# Altium schematic sheet Sheet2.SchDoc
size B; SheetNumber: 1; SheetTotal: 1
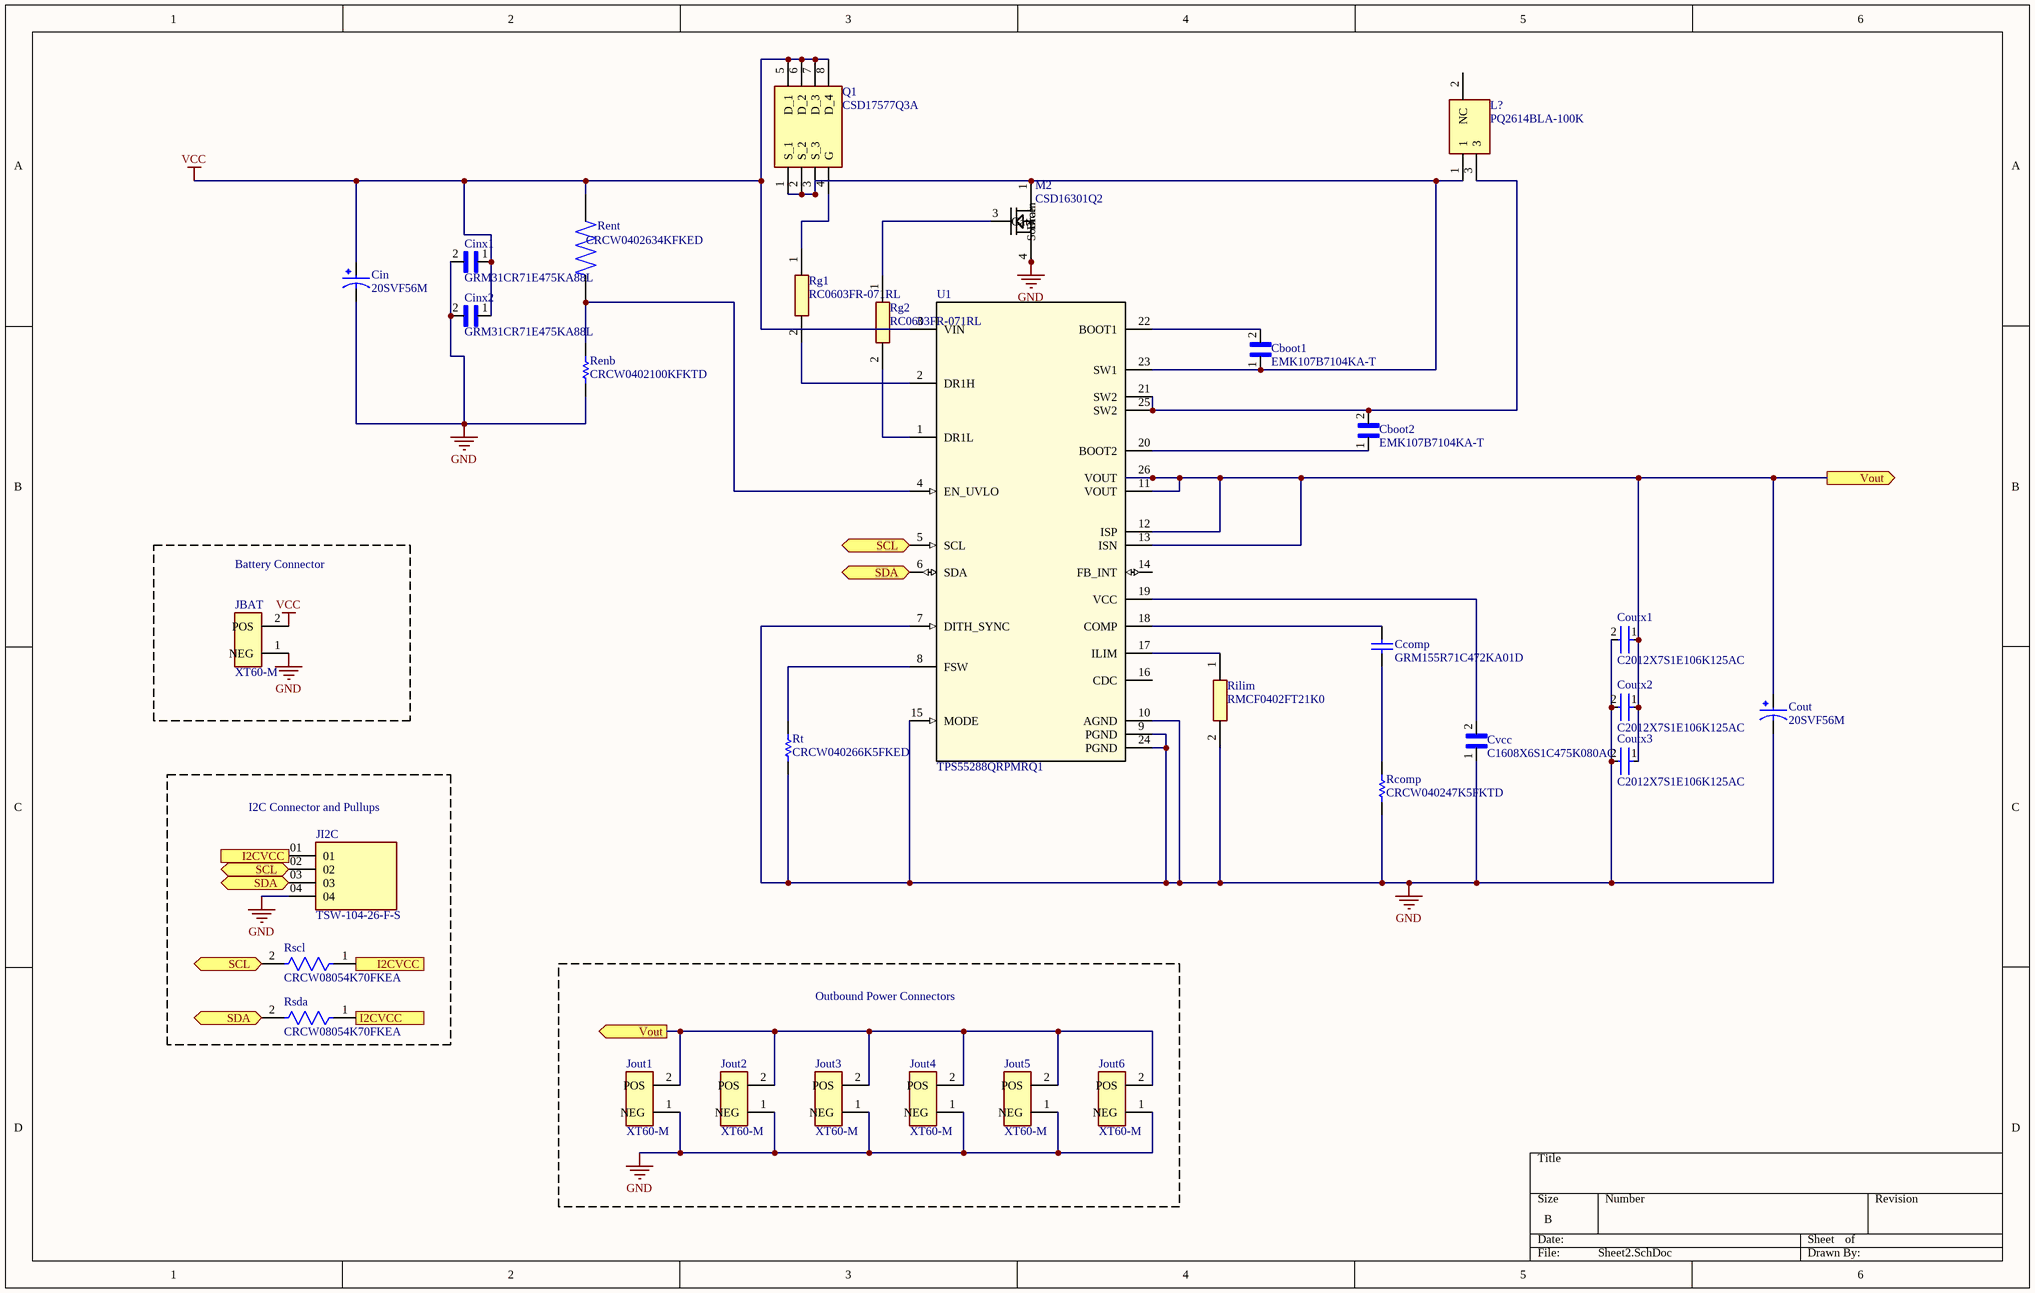
[diagram p0: Sheet2.SchDoc]

## Parts
Cboot1  EMK107B7104KA-T  [CAPC1608X90N]
Cboot2  EMK107B7104KA-T  [CAPC1608X90N]
Ccomp  GRM155R71C472KA01D  [CAPC1005X55X25LL05T10]
Cin  20SVF56M  [CAP_20SVF56M]
Cinx1  GRM31CR71E475KA88L  [CAP3216X125N]
Cinx2  GRM31CR71E475KA88L  [CAP3216X125N]
Cout  20SVF56M  [CAP_20SVF56M]
Coutx1  C2012X7S1E106K125AC  [FP-C2012-125-IPC_A]
Coutx2  C2012X7S1E106K125AC  [FP-C2012-125-IPC_A]
Coutx3  C2012X7S1E106K125AC  [FP-C2012-125-IPC_A]
Cvcc  C1608X6S1C475K080AC  [CAPC1608X90N]
JBAT  XT60-M  [AMASS_XT60-M]
JI2C  TSW-104-26-F-S  [SAMTEC_TSW-104-26-F-S]
Jout1  XT60-M  [AMASS_XT60-M]
Jout2  XT60-M  [AMASS_XT60-M]
Jout3  XT60-M  [AMASS_XT60-M]
Jout4  XT60-M  [AMASS_XT60-M]
Jout5  XT60-M  [AMASS_XT60-M]
Jout6  XT60-M  [AMASS_XT60-M]
L?  PQ2614BLA-100K  [PQ2614BLA100K]
M2  CSD16301Q2  [DQK0006C]
Q1  CSD17577Q3A  [Q3A]
Rcomp  CRCW040247K5FKTD  [RESC1005X40X25LL05T05]
Renb  CRCW0402100KFKTD  [RESC1005X40X25ML05T05]
Rent  CRCW0402634KFKED  [RESC1005X40N]
Rg1  RC0603FR-071RL  [RESC1608X55N]
Rg2  RC0603FR-071RL  [RESC1608X55N]
Rilim  RMCF0402FT21K0  [RESC1005X40N]
Rscl  CRCW08054K70FKEA  [FP-CRCW0805-e3-IPC_B]
Rsda  CRCW08054K70FKEA  [FP-CRCW0805-e3-IPC_B]
Rt  CRCW040266K5FKED  [RESC1005X40X25ML05T05]
U1  TPS55288QRPMRQ1  [RPM0026A-MFG]

## Blocks framed on the sheet
Battery Connector: JBAT
I2C Connector and Pullups: JI2C Rscl Rsda
Outbound Power Connectors: Jout1-Jout6

## Ports
I2CVCC, SCL (bidir), SDA (bidir), Vout (out)

## Nets
GND: Cin.2 Cinx1.2 Cinx2.2 Cout.2 Coutx1.2 Coutx2.2 Coutx3.2 Cvcc.1 JBAT.1(NEG) JI2C.04 Jout1.1(NEG) Jout2.1(NEG) Jout3.1(NEG) Jout4.1(NEG) Jout5.1(NEG) Jout6.1(NEG) M2.4(Source) M2.7(Source) Rcomp.1 Renb.1 Rilim.2 Rt.1 U1.7(DITH_SYNC) U1.9(PGND) U1.10(AGND) U1.15(MODE) U1.24(PGND)
VCC: Cin.1 Cinx1.1 Cinx2.1 JBAT.2(POS) Q1.5(D_1) Q1.6(D_2) Q1.7(D_3) Q1.8(D_4) Rent.2 U1.3(VIN)
I2CVCC: JI2C.01 Rscl.1 Rsda.1 ; port I2CVCC
SCL: JI2C.02 Rscl.2 U1.5(SCL) ; port SCL
SDA: JI2C.03 Rsda.2 U1.6(SDA) ; port SDA
Vout: Cout.1 Coutx1.1 Coutx2.1 Coutx3.1 Jout1.2(POS) Jout2.2(POS) Jout3.2(POS) Jout4.2(POS) Jout5.2(POS) Jout6.2(POS) U1.11(VOUT) U1.12(ISP) U1.13(ISN) U1.26(VOUT) ; port Vout
NetCboot1_1: Cboot1.1 L?.1 M2.1(Drain) M2.2(Drain) M2.5(Drain) M2.6(Drain) M2.8(Drain) Q1.1(S_1) Q1.2(S_2) Q1.3(S_3) U1.23(SW1)
NetCboot1_2: Cboot1.2 U1.22(BOOT1)
NetCboot2_1: Cboot2.1 U1.20(BOOT2)
NetCboot2_2: Cboot2.2 L?.3 U1.21(SW2) U1.25(SW2)
NetCcomp_1: Ccomp.1 Rcomp.2
NetCcomp_2: Ccomp.2 U1.18(COMP)
NetCvcc_2: Cvcc.2 U1.19(VCC)
NetM2_3: M2.3(Gate) Rg2.1
NetQ1_4: Q1.4(G) Rg1.1
NetRenb_2: Renb.2 Rent.1 U1.4(EN_UVLO)
NetRg1_2: Rg1.2 U1.2(DR1H)
NetRg2_2: Rg2.2 U1.1(DR1L)
NetRilim_1: Rilim.1 U1.17(ILIM)
NetRt_2: Rt.2 U1.8(FSW)

Not connected (* = marked no-connect by the designer): L? 2(NC); U1 14(FB_INT) 16(CDC)

## Library data of the parts
Cboot1 Cboot2 = EMK107B7104KA-T: Ceramic Multilayer Capacitor; Capacitor Type:General Purpose; Capacitance:0.1ÂµF; Capacitance Tolerance:Â± 10%; Voltage Rating:16VDC; Capacitor Dielectric Type:Multilayer Ceramic; Package/Case:0603; Termination Type:SMD ;RoHS Compliant: Yes; MF: {'manufacturer': u'Taiyo Yuden'}; MP: EMK107B7104KA-T; Price: None; Availability: Unavailable; Value: *; Package: None
Ccomp = CMP-2008-04609-1: Manufacturer: Murata; Part Number: GRM155R71C472KA01D
Cin Cout = 20SVF56M: MF: {'manufacturer': u'Panasonic'}; Value: *; Availability: Unavailable; MP: 20SVF56M; Price: None; Package: None
Cinx1 Cinx2 = GRM31CR71H475KA12L: Cap Ceramic 4.7uF 50V X7R 10% Pad SMD 1206 125C T/R; MF: {'manufacturer': u'Murata'}; Value: *; Availability: Unavailable; MP: GRM31CR71H475KA12L; Price: None; Package: None
Coutx1-Coutx3 = CMP-08246-000200-1: CAP CER 10UF 25V X7S 0805
Cvcc = C1608X6S1C475K080AC: Cap Ceramic 4.7uF 16V X6S 10% SMD 0603 105Â°C Punched Paper T/R; MF: {'manufacturer': u'TDK'}; MP: C1608X6S1C475K080AC; Price: None; Availability: Unavailable; Value: *; Package: None
JBAT Jout1-Jout6 = XT60-M: Plug; DC supply; XT60; male; PIN: 2; for cable; soldered; 30A; 500V; MF: AMASS; MP: XT60-M; Price: None; Package: Package Analog Devices; Value: *; Availability: Unavailable; SnapEDA_Link: https://www.snapeda.com/parts/XT60-M/AMASS/view-part/2883912/?ref=snap
JI2C = TSW-104-26-F-S: MF: {'manufacturer': u'Samtec'}; Value: *; Package: None; Price: None; Availability: Unavailable; MP: TSW-104-26-F-S
L? = PQ2614BLA-100K: Inductor; Manufacturer_Name: Bourns; Datasheet Link: https://www.mouser.com/datasheet/2/54/bourns_PQ2614BLA_BHA_datasheet-1159238.pdf; Height: 16mm; Manufacturer_Part_Number: PQ2614BLA-100K; Mouser Part Number: 652-PQ2614BLA-100K; Mouser Price/Stock: https://www.mouser.co.uk/ProductDetail/Bourns/PQ2614BLA-100K?qs=1mbolxNpo8dMKwtGfSvUcA%3D%3D; Arrow Part Number: PQ2614BLA-100K; Arrow Price/Stock: https://www.arrow.com/en/products/pq2614bla-100k/bourns
M2 = CSD16301Q2: No Description Available; Mfr_Name: Texas Instruments; Copyright: Copyright (C) 2022 Ultra Librarian. All rights reserved.; Manufacturer_Part_Number: CSD16301Q2; RefDes: RefDes; Type: DEV
Q1 = CSD17577Q3A: MOSFET (N-Channel); Manufacturer_Name: Texas Instruments; Datasheet Link: http://www.ti.com/lit/gpn/csd17577q3a; Manufacturer_Part_Number: CSD17577Q3A; Mouser Part Number: 595-CSD17577Q3A; Mouser Price/Stock: https://www.mouser.co.uk/ProductDetail/Texas-Instruments/CSD17577Q3A?qs=m%2F7bTylgptdTq6Yorh0Ysg%3D%3D; Arrow Part Number: CSD17577Q3A; Arrow Price/Stock: https://www.arrow.com/en/products/csd17577q3a/texas-instruments
Rcomp = CMP-2002-00418-1: Manufacturer: Vishay Dale; Part Number: CRCW040247K5FKTD
Renb = CMP-1011-00736-2: Manufacturer: Vishay Dale; Part Number: CRCW0402100KFKTD
Rent = CRCW0402634KFKED: RES, THICK FILM, 634K, 1%, 0.063W, 0402; MF: {'manufacturer': u'Vishay Dale'}; MP: CRCW0402634KFKED; Price: None; Availability: Unavailable; Value: *; Package: None
Rg1 Rg2 = RC0603FR-071RL: Resistor; Manufacturer_Name: YAGEO (PHYCOMP); Datasheet Link: https://datasheet.datasheetarchive.com/originals/distributors/Datasheets_SAMA/902f9e387b938f871d31120f5fc1d65e.pdf; Height: 0.55mm; Manufacturer_Part_Number: RC0603FR-071RL; Mouser Part Number: 603-RC0603FR-071RL; Mouser Price/Stock: https://www.mouser.co.uk/ProductDetail/YAGEO/RC0603FR-071RL?qs=VU8sRB4EgwCpR02Ip%252BqS4Q%3D%3D; Arrow Part Number: RC0603FR-071RL; Arrow Price/Stock: https://www.arrow.com/en/products/rc0603fr-071rl/yageo
Rilim = RMCF0402FT21K0: Resistor; Manufacturer_Name: Stackpole Electronics Inc.; Datasheet Link: https://www.seielect.com/catalog/sei-rmcf_rmcp.pdf; Height: 0.4mm; Manufacturer_Part_Number: RMCF0402FT21K0
Rscl Rsda = CMP-2100-03615-2: RES Thick Film, 4.7kΩ, 1%, 0.125W, 100ppm/°C, 0805; Max Power Dissipation: 125mW; Resistance: 4.7kR; Voltage Rating: 150V; Termination: SMD/SMT; Weight: 0.000194oz; Case/Package: 0805; Number of Terminations: 2; Min Operating Temperature: -55°C; Case Code (Metric): 2012; Package Quantity: 10; Depth: 1.25mm; Military Standard: Not; Composition: Thick Film; Radiation Hardening: No; Contact Plating: Tin; Height: 0.45mm; Power Rating: 125mW; Features: Automotive AEC-Q200; Tolerance: 1%; Packaging: Tape and Reel; Max Operating Temperature: 155°C; Length: 2mm; Case Code (Imperial): 0805; Voltage Rating (DC): 150V; Width: 1.25mm; Temperature Coefficient: 100ppm/°C; Lead Free: Lead Free
Rt = CMP-2002-00162-1: Manufacturer: Vishay Dale; Part Number: CRCW040266K5FKED
U1 = TPS55288QRPMRQ1: No Description Available; Mfr_Name: Texas Instruments; Type: DEV; RefDes: RefDes; Copyright: Copyright (C) 2022 Ultra Librarian. All rights reserved.; Manufacturer_Part_Number: TPS55288QRPMRQ1; Digi-Key_Part_Number_1: 296-TPS55288QRPMRQ1TR-ND; Digi-Key_Part_Number_2: 296-TPS55288QRPMRQ1CT-ND; Digi-Key_Part_Number_3: 296-TPS55288QRPMRQ1DKR-ND